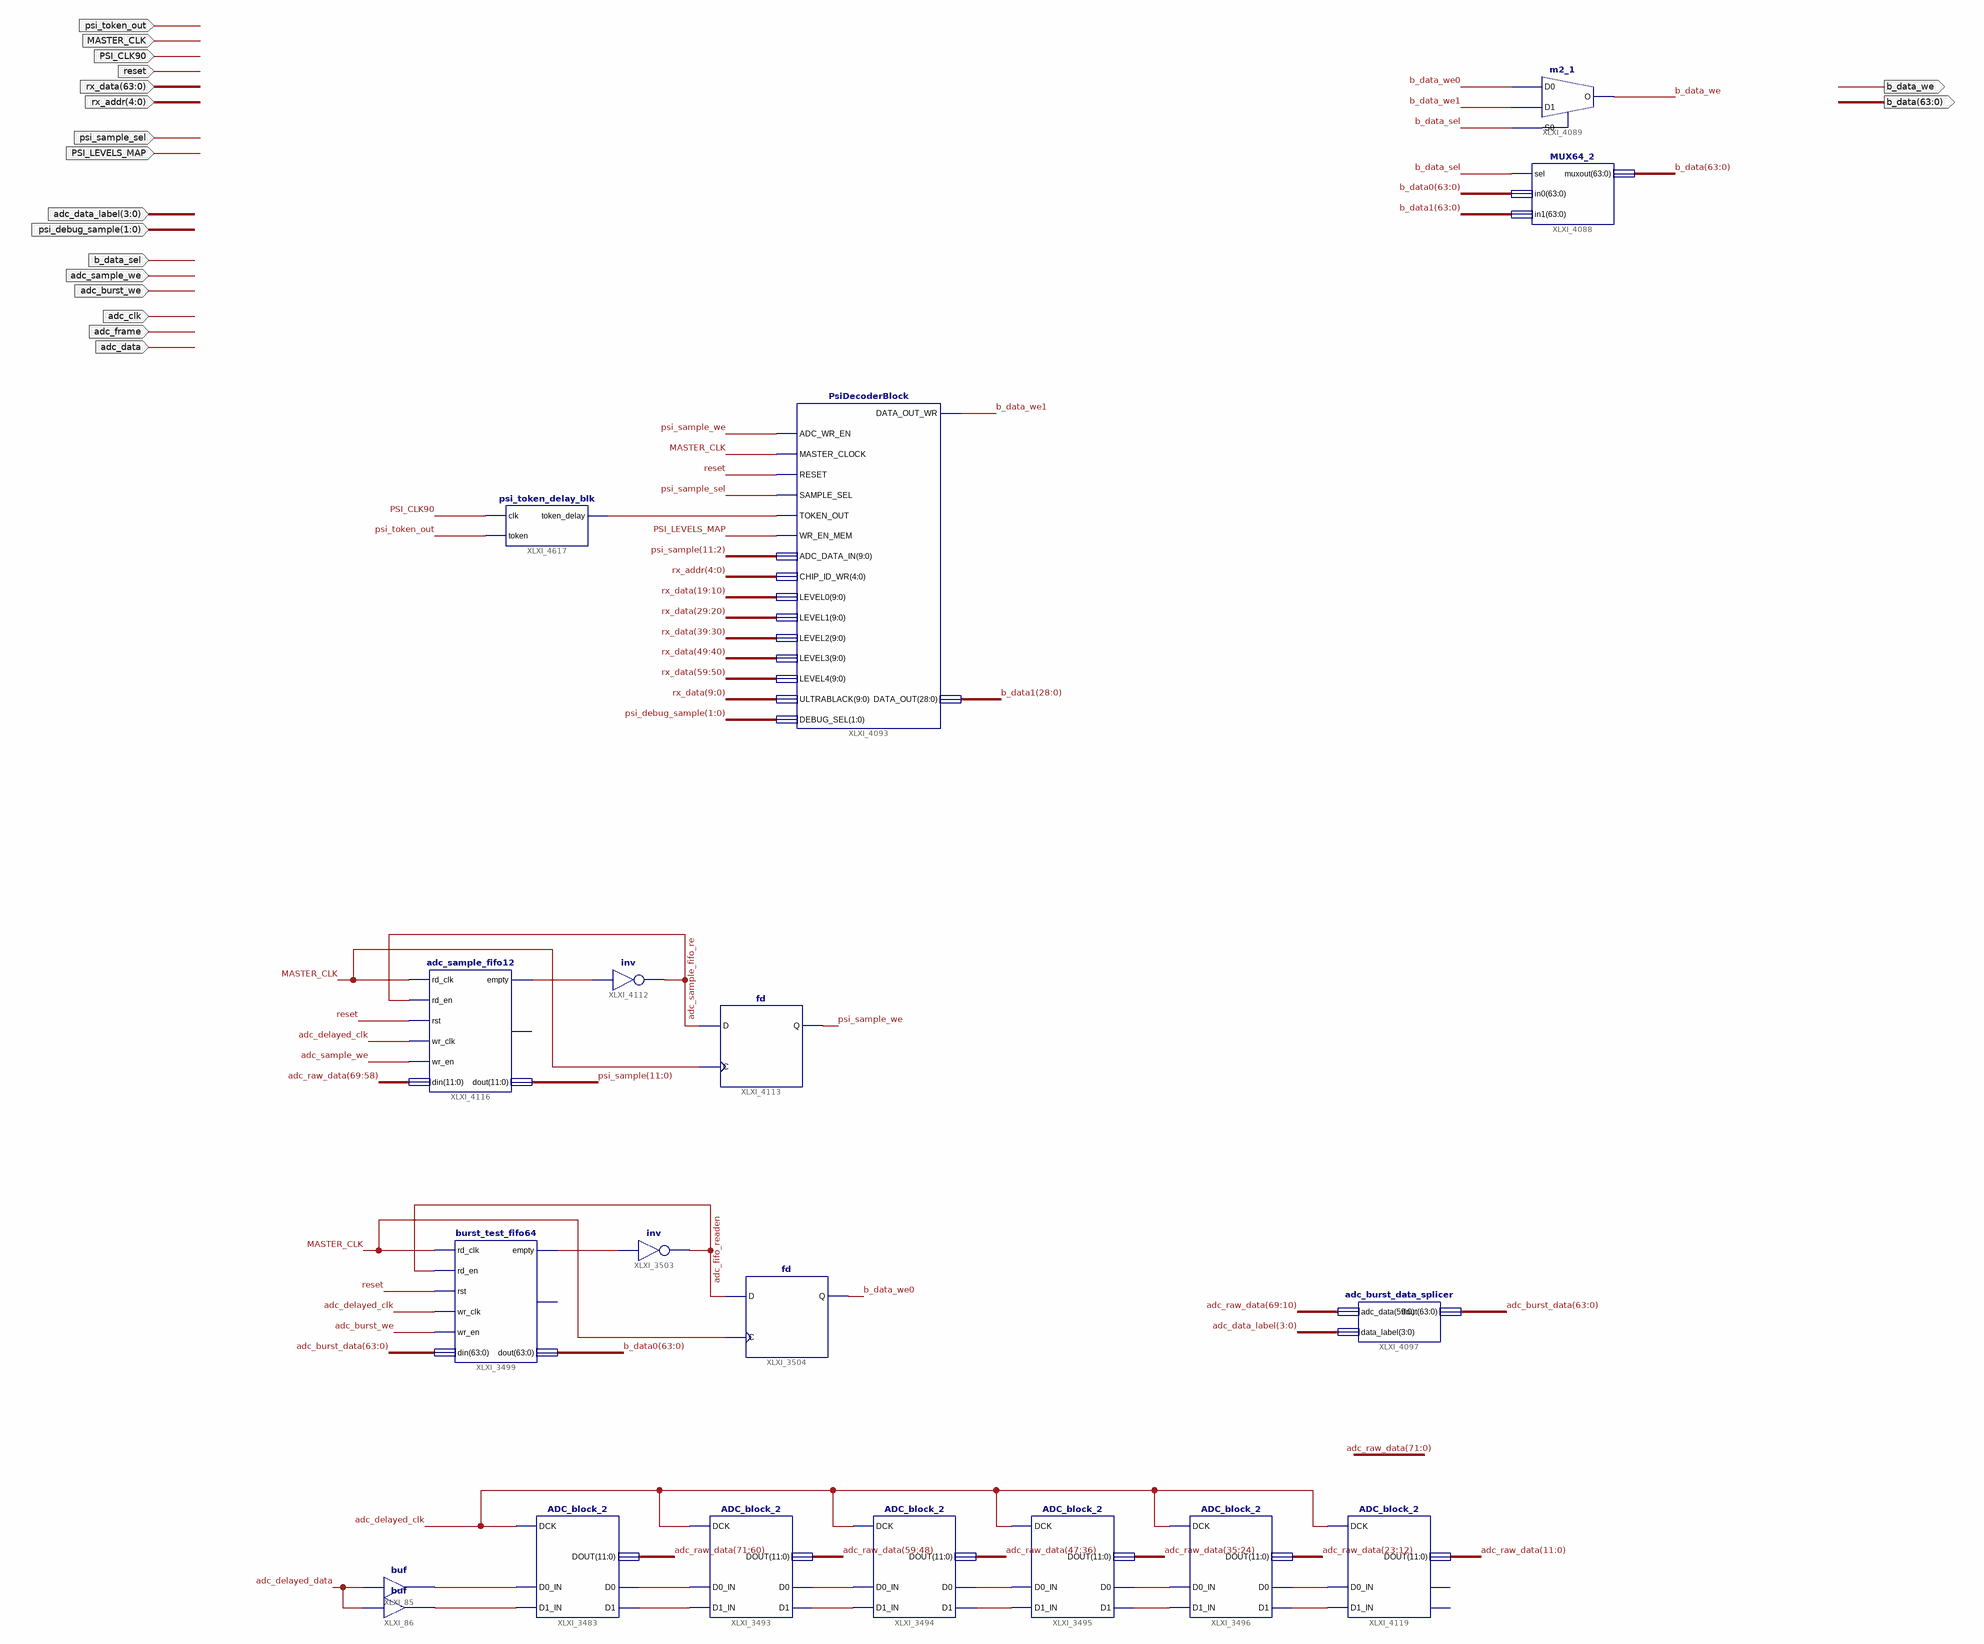
[diagram p0: schematic sheet 1]
// Xilinx ISE schematic PSI_Chip_Readout_Blk.sch (virtex4) as structural Verilog: 19 symbols, 20 ports
module PSI_Chip_Readout_Blk (
  input  adc_delayed_clk,
  input  adc_delayed_data,
  input  reset,
  input  [4:0] rx_addr,
  input  MASTER_CLK,
  input  psi_sample_sel,
  input  [1:0] psi_debug_sample,
  input  PSI_LEVELS_MAP,
  input  PSI_CLK90,
  input  psi_token_out,
  input  b_data_sel,
  input  [3:0] adc_data_label,
  input  adc_sample_we,
  input  adc_burst_we,
  input  [63:0] rx_data,
  input  adc_clk,
  input  adc_data,
  input  adc_frame,
  output b_data_we,
  output [63:0] b_data
);

  wire adc_fifo_readen, adc_sample_fifo_re, b_data_we0, b_data_we1, psi_sample_we, XLXN_12534, XLXN_12535,
       XLXN_12536, XLXN_12537, XLXN_12538, XLXN_12539, XLXN_12540, XLXN_12541, XLXN_12570, XLXN_14590,
       XLXN_14591, XLXN_14592, XLXN_14594, XLXN_14595, XLXN_15154;
  wire [11:0] psi_sample;
  wire [63:0] adc_burst_data, b_data0, b_data1;
  wire [71:0] adc_raw_data;

  ADC_block_2 XLXI_3493 (
    .DCK(adc_delayed_clk), .D0_IN(XLXN_12534), .D1_IN(XLXN_12535), .D0(XLXN_12536), .D1(XLXN_12537),
    .DOUT(adc_raw_data[59:48]));
  ADC_block_2 XLXI_3494 (
    .DCK(adc_delayed_clk), .D0_IN(XLXN_12536), .D1_IN(XLXN_12537), .D0(XLXN_12538), .D1(XLXN_12539),
    .DOUT(adc_raw_data[47:36]));
  ADC_block_2 XLXI_3495 (
    .DCK(adc_delayed_clk), .D0_IN(XLXN_12538), .D1_IN(XLXN_12539), .D0(XLXN_12540), .D1(XLXN_12541),
    .DOUT(adc_raw_data[35:24]));
  ADC_block_2 XLXI_3496 (
    .DCK(adc_delayed_clk), .D0_IN(XLXN_12540), .D1_IN(XLXN_12541), .D0(XLXN_14590), .D1(XLXN_14591),
    .DOUT(adc_raw_data[23:12]));
  buf XLXI_86 (XLXN_14595, adc_delayed_data);
  buf XLXI_85 (XLXN_14594, adc_delayed_data);
  ADC_block_2 XLXI_3483 (
    .DCK(adc_delayed_clk), .D0_IN(XLXN_14594), .D1_IN(XLXN_14595), .D0(XLXN_12534), .D1(XLXN_12535),
    .DOUT(adc_raw_data[71:60]));
  burst_test_fifo64 XLXI_3499 (
    .rd_clk(MASTER_CLK), .rd_en(adc_fifo_readen), .rst(reset), .wr_clk(adc_delayed_clk),
    .wr_en(adc_burst_we), .din(adc_burst_data), .empty(XLXN_12570), .dout(b_data0));  // open: full
  not XLXI_3503 (adc_fifo_readen, XLXN_12570);
  fd XLXI_3504 (.C(MASTER_CLK), .D(adc_fifo_readen), .Q(b_data_we0));
  not XLXI_4112 (adc_sample_fifo_re, XLXN_14592);
  fd XLXI_4113 (.C(MASTER_CLK), .D(adc_sample_fifo_re), .Q(psi_sample_we));
  adc_sample_fifo12 XLXI_4116 (
    .rd_clk(MASTER_CLK), .rd_en(adc_sample_fifo_re), .rst(reset), .wr_clk(adc_delayed_clk),
    .wr_en(adc_sample_we), .din(adc_raw_data[69:58]), .empty(XLXN_14592), .dout(psi_sample));  // open: full
  PsiDecoderBlock XLXI_4093 (
    .ADC_WR_EN(psi_sample_we), .MASTER_CLOCK(MASTER_CLK), .RESET(reset), .SAMPLE_SEL(psi_sample_sel),
    .TOKEN_OUT(XLXN_15154), .WR_EN_MEM(PSI_LEVELS_MAP), .ADC_DATA_IN(psi_sample[11:2]), .CHIP_ID_WR(rx_addr),
    .LEVEL0(rx_data[19:10]), .LEVEL1(rx_data[29:20]), .LEVEL2(rx_data[39:30]), .LEVEL3(rx_data[49:40]),
    .LEVEL4(rx_data[59:50]), .ULTRABLACK(rx_data[9:0]), .DATA_OUT_WR(b_data_we1), .DATA_OUT(b_data1[28:0]),
    .DEBUG_SEL(psi_debug_sample));
  psi_token_delay_blk XLXI_4617 (.clk(PSI_CLK90), .token(psi_token_out), .token_delay(XLXN_15154));
  MUX64_2 XLXI_4088 (.sel(b_data_sel), .in0(b_data0), .in1(b_data1), .muxout(b_data));
  m2_1 XLXI_4089 (.D0(b_data_we0), .D1(b_data_we1), .S0(b_data_sel), .O(b_data_we));
  ADC_block_2 XLXI_4119 (
    .DCK(adc_delayed_clk), .D0_IN(XLXN_14590), .D1_IN(XLXN_14591), .DOUT(adc_raw_data[11:0]));  // open: D0, D1
  adc_burst_data_splicer XLXI_4097 (.adc_data(adc_raw_data[69:10]), .data_label(adc_data_label), .dout(adc_burst_data));
endmodule
